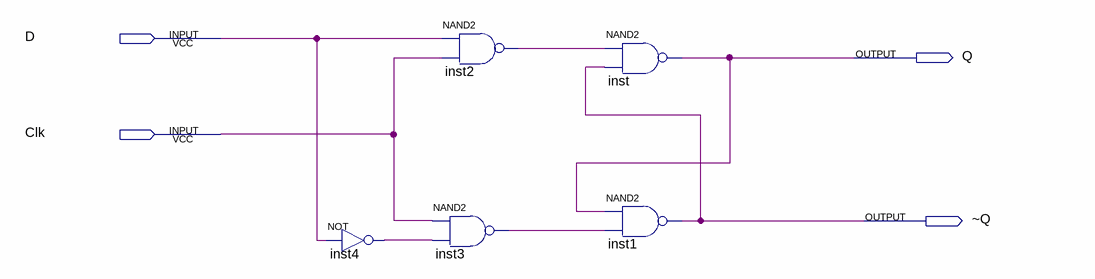
[diagram p0: schematic sheet]
// Quartus schematic lab9step2.bdf as structural Verilog: 5 symbols, 4 pins
module lab9step2 (
  input  D,
  input  Clk,
  output Q,
  output \~Q 
);

  wire inst2_out, inst3_out, inst4_out;

  not inst4 (inst4_out, D);
  nand inst2 (inst2_out, D, Clk);
  nand inst3 (inst3_out, Clk, inst4_out);
  nand inst (Q, inst2_out, \~Q );
  nand inst1 (\~Q , Q, inst3_out);
endmodule
